# EAGLE design CristmasVillage Driver 1-0 (EAGLE 6.5.0)
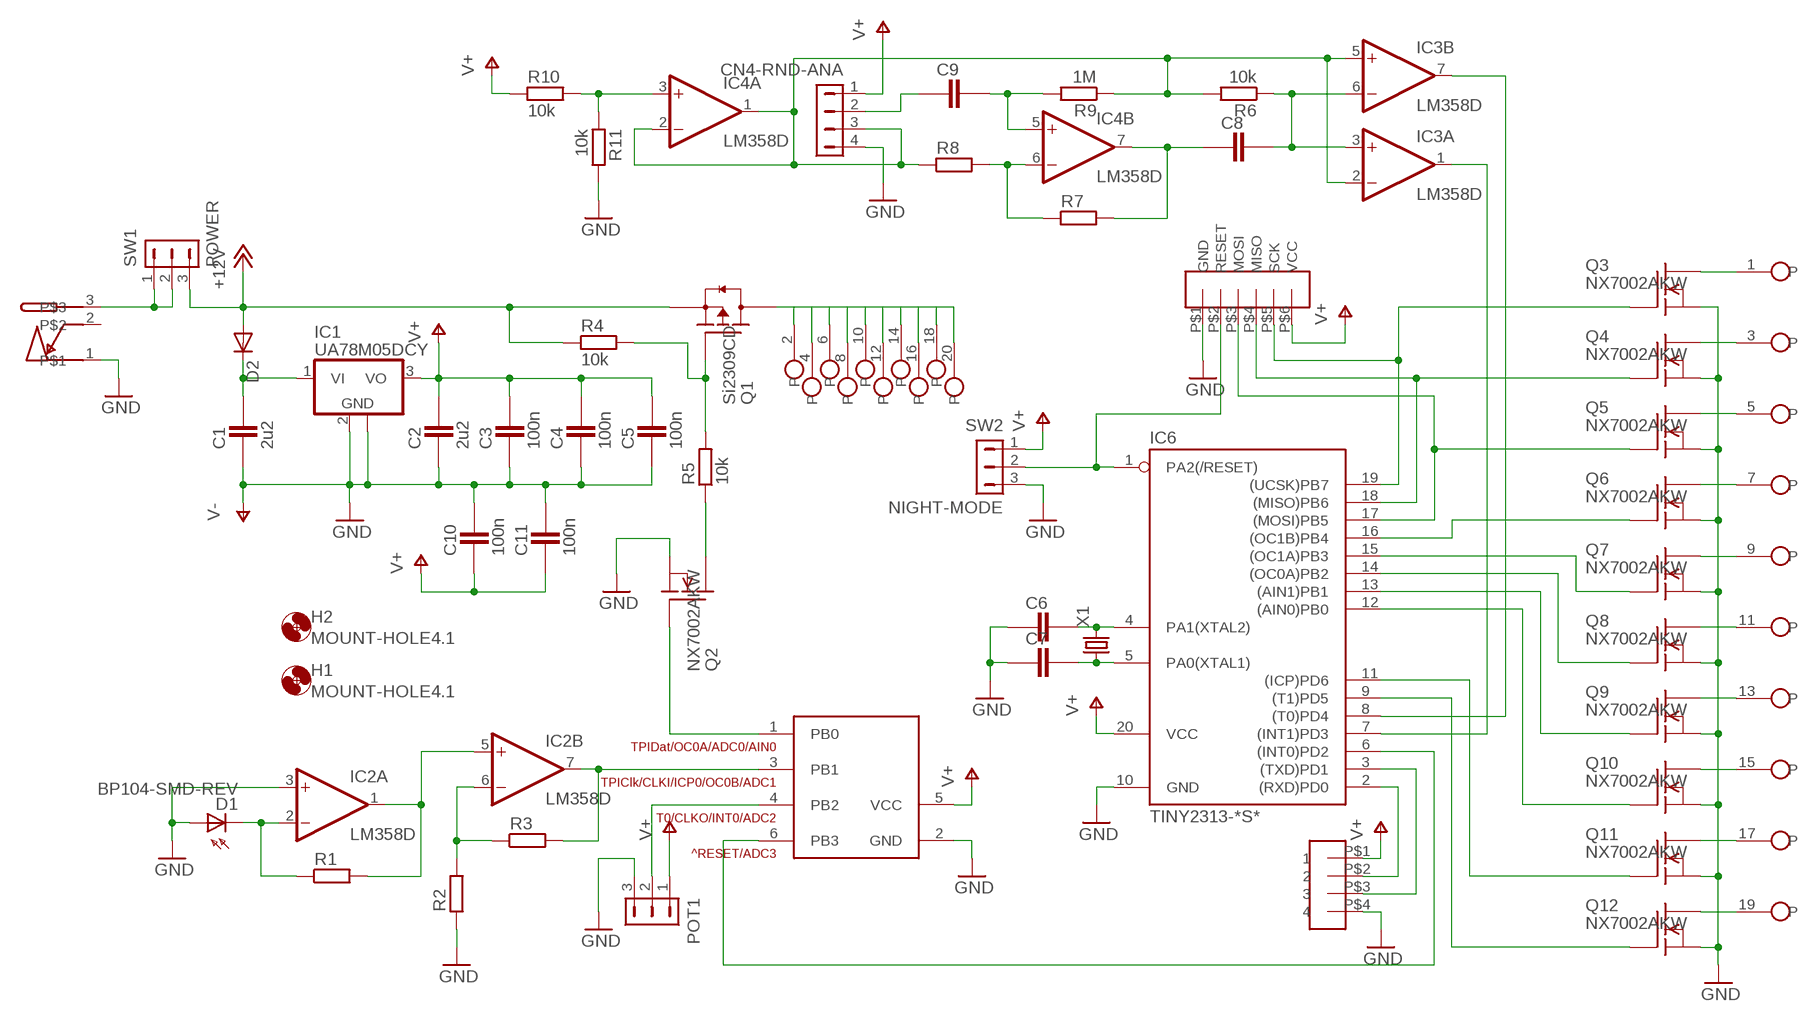
[diagram p0: schematic, sheet 1]

## Parts
C1  2u2  CAPACITOR_1206  [CAPC3215X168N]
C2  2u2  CAPACITOR_1206  [CAPC3215X168N]
C3  100n  CAPACITOR_0603  [CAPC1608X92N]
C4  100n  CAPACITOR_0603  [CAPC1608X92N]
C5  100n  CAPACITOR_0603  [CAPC1608X92N]
C6  CAPACITOR_0603  [CAPC1608X92N]
C7  CAPACITOR_0603  [CAPC1608X92N]
C8  CAPACITOR_1206  [CAPC3215X168N]
C9  CAPACITOR_1206  [CAPC3215X168N]
C10  100n  CAPACITOR_0603  [CAPC1608X92N]
C11  100n  CAPACITOR_0603  [CAPC1608X92N]
CN1  MJ-180SMT  [MJ-180SMT]
CN2-PROG  JST-6PSPI-SIDE-S6B  [6P-H]
CN3-SERIAL  JST-4PSIDE-S4B  [4P-H]
CN4-RND-ANA  HDR-1X4-SIP-100  [SIP-100-4V]
CN5-LEDSTRIPS  HDR_2X10_SIDE-MOUNT  [20PIN-10TOP-10BOT]
D1  BP104-SMD-REV  [BR104SMDREV]
D2  DIODE-MINIMELF  [MINIMELF]
H1  MOUNT-HOLE4.1  [4,1]
H2  MOUNT-HOLE4.1  [4,1]
IC1  UA78M05DCY  [SOT223]
IC2  LM358D  [SO08]
IC3  LM358D  [SO08]
IC4  LM358D  [SO08]
IC5  ATTINY-4/5/9/10  [SOT23-6]
IC6  TINY2313-*S*  [SO20L$]
POT1  HDR-1X3-MTE-100  [MTE-100-3V]
Q1  Si2309CD  MOSFET-PCH_SOT-23  [SOT95P280X135-3N]
Q2  NX7002AKW  [SOT323R]
Q3  NX7002AKW  [SOT323R]
Q4  NX7002AKW  [SOT323R]
Q5  NX7002AKW  [SOT323R]
Q6  NX7002AKW  [SOT323R]
Q7  NX7002AKW  [SOT323R]
Q8  NX7002AKW  [SOT323R]
Q9  NX7002AKW  [SOT323R]
Q10  NX7002AKW  [SOT323R]
Q11  NX7002AKW  [SOT323R]
Q12  NX7002AKW  [SOT323R]
R1  RESISTOR_0603  [RESC1608X55N]
R2  RESISTOR_0603  [RESC1608X55N]
R3  RESISTOR_0603  [RESC1608X55N]
R4  10k  RESISTOR_0603  [RESC1608X55N]
R5  10k  RESISTOR_0603  [RESC1608X55N]
R6  10k  RESISTOR_0603  [RESC1608X55N]
R7  RESISTOR_0603  [RESC1608X55N]
R8  RESISTOR_0603  [RESC1608X55N]
R9  1M  RESISTOR_0603  [RESC1608X55N]
R10  10k  RESISTOR_0603  [RESC1608X55N]
R11  10k  RESISTOR_0603  [RESC1608X55N]
SW1  POWER  HDR-1X3-MTE-100  [MTE-100-3V]
SW2  NIGHT-MODE  HDR-1X3-MTE-100  [MTE-100-3V]
X1  CRYSTALSM49  [SM49]

## Nets
+12V: D2.A Q1.2(S) R4.1 SW1.3
GND: C1.1 C2.1 C3.1 C4.1 C5.1 C6.1 C7.1 C10.2 C11.2 CN1.1 CN2-PROG.P$1(GND) CN3-SERIAL.P$4 CN4-RND-ANA.4 D1.1(A) IC1.2(GND) IC1.4(GND) IC2.3(A:+IN) IC5.2(GND) IC6.10(GND) POT1.3 Q2.2(S) Q3.2(S) Q4.2(S) Q5.2(S) Q6.2(S) Q7.2(S) Q8.2(S) Q9.2(S) Q10.2(S) Q11.2(S) Q12.2(S) R2.1 R11.2 SW2.3 ; supply symbol labelled V-
HALF-VCC: CN4-RND-ANA.3 IC3.2(A:-IN) IC3.5(B:+IN) IC4.1(A:OUT) IC4.2(A:-IN) R6.2 R8.1 R9.1
MISO: CN2-PROG.P$4(MISO) IC6.18((MISO)PB6) Q4.1(G)
MOSI: CN2-PROG.P$3(MOSI) IC6.17((MOSI)PB5) Q5.1(G)
N$1: C1.2 D2.C IC1.1(VI)
N$2: D1.2(C) IC2.2(A:-IN) R1.1
N$3: IC2.1(A:OUT) IC2.5(B:+IN) R1.2
N$4: CN3-SERIAL.P$2 IC6.2((RXD)PD0)
N$5: CN3-SERIAL.P$3 IC6.3((TXD)PD1)
N$6: IC2.6(B:-IN) R2.2 R3.1
N$7: IC2.7(B:OUT) IC5.3(PB1) R3.2
N$8: IC6.9((T1)PD5) Q12.1(G)
N$9: IC5.1(PB0) Q2.1(G)
N$10: IC6.11((ICP)PD6) Q11.1(G)
N$11: C6.2 IC6.4(PA1(XTAL2)) X1.2
N$12: C7.2 IC6.5(PA0(XTAL1)) X1.1
N$13: IC6.12((AIN0)PB0) Q10.1(G)
N$14: IC6.13((AIN1)PB1) Q9.1(G)
N$15: IC6.14((OC0A)PB2) Q8.1(G)
N$16: IC6.15((OC1A)PB3) Q7.1(G)
N$17: CN2-PROG.P$2(RESET) IC6.1(PA2(/RESET)) SW2.2
N$18: IC5.6(PB3) IC6.6((INT0)PD2)
N$19: IC5.4(PB2) POT1.2
N$20: IC6.16((OC1B)PB4) Q6.1(G)
N$21: CN5-LEDSTRIPS.1 Q3.3(D)
N$22: CN1.3 SW1.1 SW1.2
N$23: CN5-LEDSTRIPS.3 Q4.3(D)
N$24: CN5-LEDSTRIPS.5 Q5.3(D)
N$25: CN5-LEDSTRIPS.7 Q6.3(D)
N$26: CN5-LEDSTRIPS.9 Q7.3(D)
N$27: CN5-LEDSTRIPS.11 Q8.3(D)
N$28: CN5-LEDSTRIPS.13 Q9.3(D)
N$29: CN5-LEDSTRIPS.15 Q10.3(D)
N$30: CN5-LEDSTRIPS.17 Q11.3(D)
N$31: CN5-LEDSTRIPS.19 Q12.3(D)
N$32: CN5-LEDSTRIPS.2 CN5-LEDSTRIPS.4 CN5-LEDSTRIPS.6 CN5-LEDSTRIPS.8 CN5-LEDSTRIPS.10 CN5-LEDSTRIPS.12 CN5-LEDSTRIPS.14 CN5-LEDSTRIPS.16 CN5-LEDSTRIPS.18 CN5-LEDSTRIPS.20 Q1.3(D)
N$33: Q1.1(G) R4.2 R5.2
N$34: Q2.3(D) R5.1
N$35: IC3.1(A:OUT) IC6.7((INT1)PD3)
N$36: IC3.7(B:OUT) IC6.8((T0)PD4)
N$37: C8.2 IC3.3(A:+IN) IC3.6(B:-IN) R6.1
N$38: IC4.3(A:+IN) R10.2 R11.1
N$39: C8.1 IC4.7(B:OUT) R7.2
N$40: IC4.6(B:-IN) R7.1 R8.2
N$41: C9.2 IC4.5(B:+IN) R9.2
RANDOM-ANALOG-SIG: C9.1 CN4-RND-ANA.2
SCK: CN2-PROG.P$5(SCK) IC6.19((UCSK)PB7) Q3.1(G)
V+: C2.2 C3.2 C4.2 C5.2 C10.1 C11.1 CN2-PROG.P$6(VCC) CN3-SERIAL.P$1 CN4-RND-ANA.1 IC1.3(VO) IC5.5(VCC) IC6.20(VCC) POT1.1 R10.1 SW2.1
Unconnected: CN1.2

## Power pins joined to a net without a drawn wire
GND: IC2.4(P:V-) IC3.4(P:V-) IC4.4(P:V-)
V+: IC2.8(P:V+) IC3.8(P:V+) IC4.8(P:V+)

## Library data of the parts
C1-C11 = ipc-7351-capacitor:CAPACITOR_
CN1 = con-Multicomp:MJ-180SMT
CN2-PROG = avr-6:JST-6P
CN3-SERIAL = Connector-2mm:JST-4P
CN4-RND-ANA = con-hdrs40:HDR-1X4: HEADER CONNECTOR
CN5-LEDSTRIPS = con-SideHeader:HDR_2X10_SIDE-MOUNT
D1 = Vishay:BP104: PHOTO DIODE
D2 = diode:DIODE-: DIODE
H1 H2 = holes:MOUNT-HOLE: MOUNTING HOLE with drill center marker
IC1 = linear:UA78M*: POSITIVE-VOLTAGE REGULATORS Source: http://focus.ti.com/lit/ds/symlink/ua78m33.pdf
IC2-IC4 = linear4:LM358: OP AMP
IC5 = avr-6:ATTINY-4/5/9/10
IC6 = avr-6:TINY2313*: Atmel Tiny2313 2K Flash, 128 bytes EEPROM, 128 bytes RAM
POT1 SW1 SW2 = con-hdrs40:HDR-1X3: HEADER CONNECTOR
Q1 = ipc-7351-transistor:MOSFET-PCH_
Q2-Q12 = ZeroCross Project:NX7002AKW
R1-R11 = ipc-7351-resistor:RESISTOR_
X1 = crystal:CRYSTAL: CRYSTAL

## Board
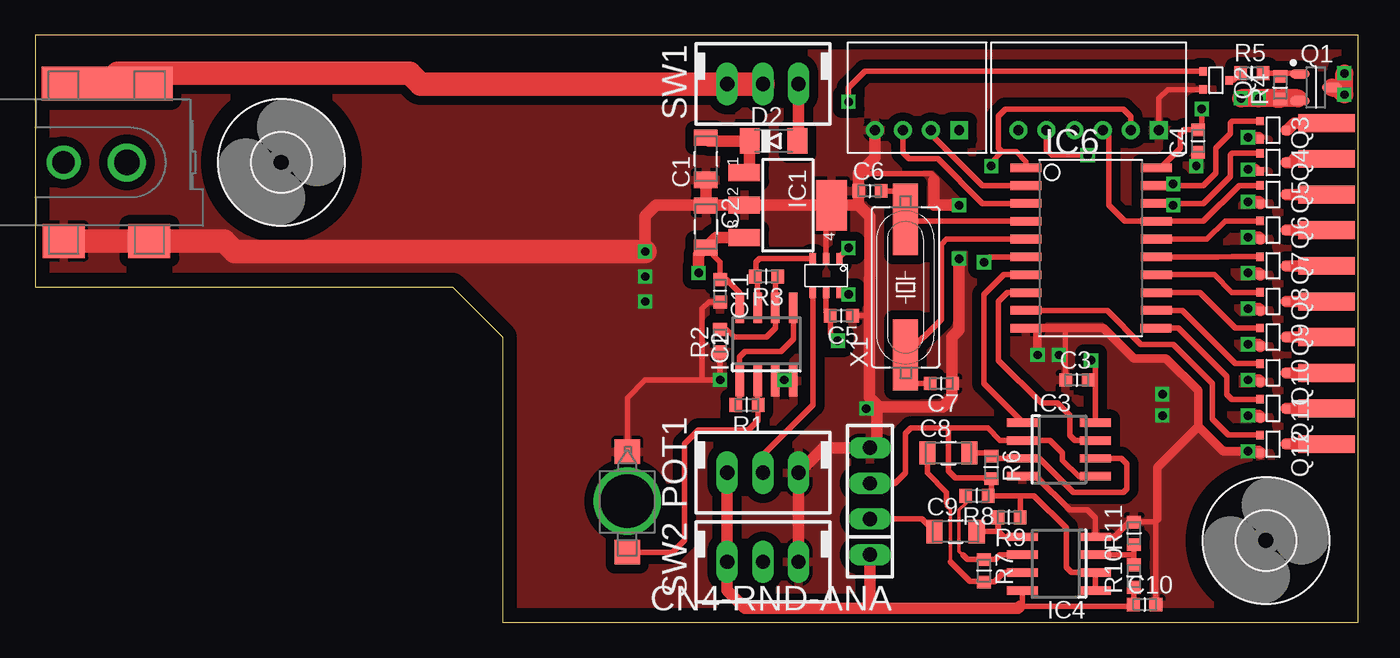
[diagram p1: board, top side]
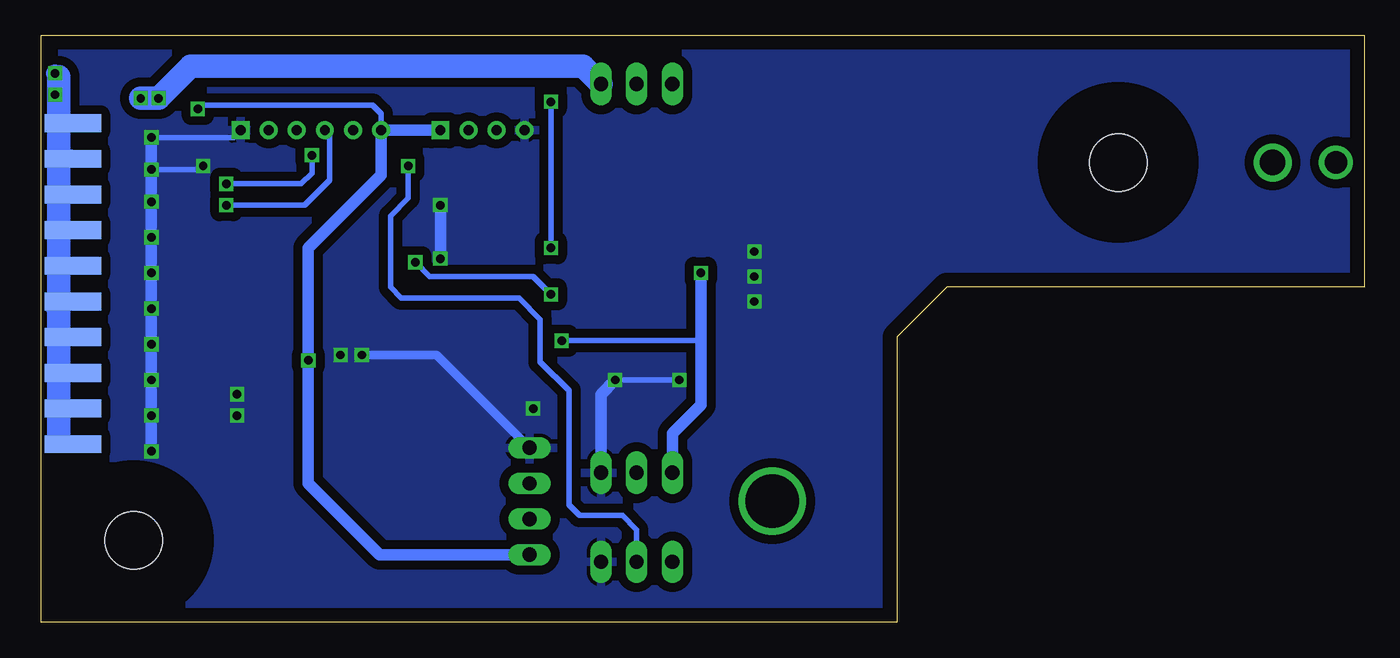
[diagram p2: board, bottom side, seen from below]

Size 94.21 x 41.83 mm. Coordinates in mm from the lower left corner, seen from the top.
Outline: 33.27,0 94.21,0 94.21,41.83 0,41.83 0,23.88 29.72,23.88 33.27,20.32 33.27,0
Copper layers (1*16): Top 0.035mm / dielectric 1.5mm / Bottom 0.035mm
Design rules "default": minimum track width 10mil, minimum drill 24mil, track to track 8mil, track to pad 8mil, pad to pad 8mil, via to via 8mil, smd to smd 8mil, copper to edge 40mil, drill to drill 8mil, minimum pad ring 10mil, minimum via ring 8mil, stop-mask expansion 4mil, vias tented up to drill 0mil, thermal gap 10mil

### Footprints (pad centres in the part's own frame; a part is rotated, then mirrored left to right if it is on the bottom)
CAPC3215X168N = smd 1.15 x 1.65: 1 -1.5,0; 2 1.5,0
CAPC1608X92N = smd 0.9 x 0.95: 1 -0.8,0; 2 0.8,0
MJ-180SMT = smd 3 x 2.4: 1 0,-5.6; 2 6.1,-5.6 | smd 9.3 x 2.4: 3 3.1,5.6 | drill 1.6 pad 1.93: P$1 0,0 | drill 1.8 pad 2.184: P$2 4.5,0
6P-H = drill 0.7 pad 1.27 square: P$1 0,0 | drill 0.7 pad 1.27: P$2 2,0; P$3 4,0; P$4 6,0; P$5 8,0; P$6 10,0
4P-H = drill 0.7 pad 1.27 square: P$1 0,0 | drill 0.7 pad 1.27: P$2 2,0; P$3 4,0; P$4 6,0
SIP-100-4V = drill 1.016 long: 1 -3.81,0; 2 -1.27,0; 3 1.27,0; 4 3.81,0
20PIN-10TOP-10BOT = smd 1.27 x 4: 1 0,0; 3 2.54,0; 5 5.08,0; 7 7.62,0; 9 10.16,0; 11 12.7,0; 13 15.24,0; 15 17.78,0; 17 20.32,0; 19 22.86,0 | smd 1.27 x 4 bottom: 2 0,0; 4 2.54,0; 6 5.08,0; 8 7.62,0; 10 10.16,0; 12 12.7,0; 14 15.24,0; 16 17.78,0; 18 20.32,0; 20 22.86,0
BR104SMDREV = smd 1.75 x 1.8: 1 -3.525,0; 2 3.625,0 | drill 3.8 pad 3.8: P$1 0,0
MINIMELF = smd 1.4 x 1.8: A 1.7,0; C -1.7,0
4,1 = hole 4.1: 0,0
SOT223 = smd 1.219 x 2.235: 1 -2.311,-3.099; 2 0,-3.099; 3 2.311,-3.099 | smd 3.6 x 2.2: 4 0,3.099
SO08 = smd 0.6 x 2.2: 1 -1.905,-2.6; 2 -0.635,-2.6; 3 0.635,-2.6; 4 1.905,-2.6; 5 1.905,2.6; 6 0.635,2.6; 7 -0.635,2.6; 8 -1.905,2.6
SOT23-6 = smd 0.8 x 0.45: 1 0,1.9; 2 0,0.95; 3 0,0; 4 2.4,0; 5 2.4,0.95; 6 2.4,1.9
SO20L$ = smd 0.61 x 2.21: 1 -5.715,-4.636; 2 -4.445,-4.636; 3 -3.175,-4.636; 4 -1.905,-4.636; 5 -0.635,-4.636; 6 0.635,-4.636; 7 1.905,-4.636; 8 3.175,-4.636; 9 4.445,-4.636; 10 5.715,-4.636; 11 5.715,4.61; 12 4.445,4.636; 13 3.175,4.636; 14 1.905,4.636; 15 0.635,4.636; 16 -0.635,4.636; 17 -1.905,4.636; 18 -3.175,4.636; 19 -4.445,4.636; 20 -5.715,4.636
MTE-100-3V = drill 1.016 long: 1 -2.54,0; 2 0,0; 3 2.54,0
SOT95P280X135-3N = smd 1.4 x 0.65: 1 -1.15,0.95; 2 -1.15,-0.95; 3 1.15,0
SOT323R = smd 0.6 x 0.55: 1 -0.65,-0.925; 2 0.65,-0.925; 3 0,0.925
RESC1608X55N = smd 0.9 x 1: 1 -0.8,0; 2 0.8,0
SM49 = smd 5.08 x 1.778: 1 -4.826,0; 2 4.826,0

### Placement (x,y rotation side)
C1  47.75,33.02 90 top
C2  47.75,28.19 270 top
C3  74.17,17.27 0 top
C4  82.8,34.29 90 top
C5  57.4,21.84 180 top
C6  59.44,30.73 0 top
C7  64.52,17.02 180 top
C8  65.02,12.07 0 top
C9  65.53,6.48 0 top
C10  78.99,1.27 0 top
C11  48.77,23.62 270 top
CN1  2.03,32.77 0 top
CN2-PROG  80.01,35.05 180 top
CN3-SERIAL  65.79,35.05 180 top
CN4-RND-ANA  59.44,8.64 90 top
CN5-LEDSTRIPS  91.95,35.56 270 top
D1  42.16,8.64 270 top
D2  52.58,34.29 0 top
H1  87.63,5.84 0 top
H2  17.53,32.77 0 top
IC1  53.59,29.72 270 top
IC2  52.07,19.81 0 top
IC3  72.9,12.32 270 top
IC4  72.9,4.19 90 top
IC5  55.37,25.91 270 top
IC6  75.18,26.67 270 top
POT1  51.82,10.67 0 top
Q1  91.19,38.1 0 top
Q2  84.07,38.61 270 top
Q3  88.14,35.05 270 top
Q4  88.14,32.77 270 top
Q5  88.14,30.48 270 top
Q6  88.14,27.94 270 top
Q7  88.14,25.4 270 top
Q8  88.14,22.86 270 top
Q9  88.14,20.32 270 top
Q10  88.14,17.78 270 top
Q11  88.14,15.24 270 top
Q12  88.14,12.7 270 top
R1  50.67,15.49 180 top
R2  48.77,20.07 90 top
R3  52.07,24.64 180 top
R4  88.65,38.1 90 top
R5  86.61,39.12 0 top
R6  68.07,11.05 270 top
R7  67.56,3.68 270 top
R8  67.06,9.02 180 top
R9  69.34,7.49 180 top
R10  78.23,3.3 90 top
R11  78.23,6.35 90 top
SW1  51.82,38.35 0 top
SW2  51.82,4.32 0 top
X1  61.98,23.88 90 top

### Tracks (layer width: path | path; a pad name or v marks a point on that pad's centre or on a via)
+12V  (via drill 0.6)
  Top 0.813: Q1.2 90.04,37.22 89.92,37.34 | SW1.3 54.36,34.37 D2.A
  Top 1.27: 89.92,37.34 88.68,37.34 R4.1 88.43,37.3 88.39,37.34 v87.12,37.34 v85.85,37.34
  Bottom 1.676: SW1.3 55.63,39.62 83.57,39.62 v85.85,37.34 v87.12,37.34
GND  (via drill 0.6)
  Top 0.305: 55.81,29.65 55.88,29.72
  Top 0.406: Q3.2 87.21,34.45 87.12,34.54 | 86.87,32.26 87.07,32.26 Q4.2 | CN2-PROG.P$1 80.01,37.34 80.63,37.96 Q2.2 | C4.1 82.8,32.64 v82.68,32.51 | 58.64,31.97 63.79,31.97 64.01,31.75 64.01,31.5 | C3.1 73.37,20.92 73.41,20.96 | IC3.4 71.25,10.41 73.66,8 74.93,8 75.5,7.43 IC4.4 76.83,6.1 77.89,7.15 R11.2 79.76,7.15 79.79,7.11 | C10.2 79.79,7.11 | 79.79,7.11 79.79,7.28 79.88,7.37 | IC5.2 56.32,29.35 IC1.4 | C5.1 59.16,21.84 59.42,21.59 | IC6.10 71.25,20.96 71.37,20.83 | R2.1 v48.77,17.27 47.5,17.27 | IC2.4 53.91,17.27 v53.34,17.27 52.83,17.27 52.77,17.21 IC2.3 | 47.5,17.27 47.5,22.35 47.97,22.82 C11.2 | 42.64,12.16 D1.1 42.16,16 43.43,17.27 47.5,17.27
  Top 0.61: IC6.10 73.41,20.96 76.07,20.96 78.23,18.8 80.52,18.8 82.8,16.51 82.8,13.97 | 82.8,13.97 84.58,12.19 v86.36,12.19 | 79.88,7.37 79.88,11.05 82.8,13.97 | 71.37,20.83 v71.37,19.05
  Top 0.813: 87.12,34.54 v86.36,34.54 | v86.36,32.26 86.87,32.26 | Q5.2 87.21,29.88 87.12,29.97 v86.36,29.97 | Q6.2 87.21,27.34 87.12,27.43 v86.36,27.43 | Q7.2 87.21,24.8 87.12,24.89 v86.36,24.89 | Q8.2 87.21,22.26 87.12,22.35 v86.36,22.35 | Q9.2 87.21,19.72 87.12,19.81 v86.36,19.81 | Q10.2 87.21,17.18 87.12,17.27 v86.36,17.27 | Q11.2 87.21,14.64 87.12,14.73 v86.36,14.73 | Q12.2 87.21,12.1 87.12,12.19 v86.36,12.19 | 58.64,29.72 C6.1 58.64,31.97 59.79,33.12 CN3-SERIAL.P$4 | 58.64,29.72 59.44,28.92 59.44,27.69 59.42,21.59 59.4,16.04 60.07,15.37 | v65.79,25.91 65.79,20.83 65.28,20.32 65.28,17.06 C7.1 65.28,16.98 65.28,16 64.64,15.37 60.07,15.37 | v65.79,29.72 64.01,29.72 64.01,31.5 | 60.07,15.37 59.94,15.37 59.94,12.95 CN4-RND-ANA.4 56.13,12.45 POT1.3 SW2.3 | C1.1 C2.1 | C2.1 47.78,29.72 IC1.2 55.88,29.72 IC1.4 58.64,29.72 | v43.43,26.42 43.43,28.96 44.2,29.72 47.73,29.72 C2.1
  Top 1.676: CN1.1 8.12,27.17 8.13,27.18 13.46,27.18 14.22,26.42 v43.43,26.42
  Bottom 0.406: v86.36,34.54 80.52,34.54 CN2-PROG.P$1 | v82.68,32.51 82.93,32.26 v86.36,32.26 | v48.77,17.27 v53.34,17.27
  Bottom 0.61: v71.37,19.05 66.04,19.05 CN4-RND-ANA.4
  Bottom 0.813: v86.36,34.54 v86.36,32.26 v86.36,29.97 v86.36,27.43 v86.36,24.89 v86.36,22.35 v86.36,19.81 v86.36,17.27 v86.36,14.73 v86.36,12.19 | v65.79,29.72 v65.79,25.91 | POT1.3 54.36,16.26 v53.34,17.27
  other vias: 43.43,24.64 43.43,22.86 59.18,15.24 72.9,19.05 80.26,16.26 80.26,14.73
  pour Bottom (isolate 0.635): 33.27,20.32 29.72,23.88 0,23.88 0,41.91 94.23,41.91 94.23,0 33.27,0
  pour Top (isolate 0.635): 0,23.88 0,40.39 1.52,41.91 94.23,41.91 94.23,0 33.27,0 33.27,20.32 29.72,23.88
HALF-VCC
  Top 0.406: IC3.5 74.3,10.41 73.15,11.56 73.15,12.07 72.26,12.95 IC3.2 68.71,12.95 67.82,13.84 65.15,13.84 | IC4.1 IC4.2 73.79,3.56 73.41,3.94 73.41,6.73 71.12,9.02 70.1,9.02 | R9.1 70.14,8.98 70.1,9.02 | 70.1,9.02 R8.1 68.07,9.23 R6.2 67.6,10.25 67.56,10.29 65.53,10.29 65.02,10.79 65.02,13.72 65.15,13.84 | CN4-RND-ANA.3 61.21,9.91 61.98,10.67 61.98,13.46 62.36,13.84 65.15,13.84
MISO  (via drill 0.6)
  Top 0.406: Q4.1 85.23,33.42 85.09,33.27 85.09,31.75 83.19,29.85 IC6.18 80.9,29.85 v81.03,29.72
  Bottom 0.406: v81.03,29.72 75.44,29.72 73.66,31.5 73.66,34.7 CN2-PROG.P$4
MOSI
  Top 0.406: Q5.1 85.74,31.13 83.19,28.57 IC6.17 77.6,28.57 76.45,29.72 76.45,34.61 CN2-PROG.P$3
N$1
  Top 0.813: C1.2 47.98,34.29 D2.C 50.88,32.41 IC1.1
N$2
  Top 0.406: IC2.2 51.44,15.53 R1.1 51.47,14.39 50.8,13.72 47.24,13.72 46.23,12.7 46.23,5.84 45.4,5.01 D1.2
N$3
  Top 0.406: IC2.5 53.97,20.19 53.09,19.3 50.55,19.3 50.16,18.92 IC2.1 50.16,15.79 R1.2
N$4
  Top 0.406: CN3-SERIAL.P$2 63.79,34.77 67.44,31.11 IC6.2
N$5
  Top 0.406: IC6.3 67.44,29.85 64.26,33.02 62.23,33.02 61.79,33.46 CN3-SERIAL.P$3
N$6
  Top 0.406: R3.1 52.7,24.47 IC2.6 52.7,20.96 52.07,20.32 49.78,20.32 49.28,20.83 48.81,20.83 R2.2
N$7
  Top 0.406: IC5.3 51.56,25.91 51.31,25.65 51.31,24.68 R3.2 51.44,24.47 IC2.7
N$8
  Top 0.406: IC6.9 76.33,22.22 78.74,19.81 81.03,19.81 83.82,17.02 83.82,14.48 84.95,13.35 Q12.1
N$9  (via drill 0.6)
  Top 0.406: IC5.1 57.27,26.03 v57.91,26.67 | v57.91,37.08 57.91,38.1 59.07,39.26 Q2.1
  Bottom 0.406: v57.91,26.67 v57.91,37.08
N$10
  Top 0.406: IC6.11 81.41,20.96 84.84,17.53 84.84,16.26 85.2,15.89 Q11.1
N$11
  Top 0.406: IC6.4 62.1,28.57 X1.2 61.98,30.48 61.72,30.73 C6.2
N$12
  Top 0.406: IC6.5 64.9,27.31 64.52,26.92 64.52,21.59 X1.1 61.98,17.53 62.48,17.02 C7.2
N$13
  Top 0.406: IC6.12 81.66,22.22 85.46,18.43 Q10.1
N$14
  Top 0.406: IC6.13 82.93,23.5 85.46,20.97 Q9.1
N$15
  Top 0.406: IC6.14 83.95,24.76 85.2,23.51 Q8.1
N$16
  Top 0.406: Q7.1 85.23,26.05 84.2,26.04 IC6.15
N$17  (via drill 0.6)
  Top 0.406: CN2-PROG.P$2 78.01,36.04 77.47,36.58 69.09,36.58 68.58,36.07 68.58,33.78 68.83,33.53 | 68.83,33.53 69.85,33.53 70.55,32.83 IC6.1 | v68.07,32.51 68.07,32.77 68.83,33.53
  Bottom 0.406: SW2.2 51.82,6.6 52.83,7.62 55.88,7.62 56.64,8.38 56.64,16.51 58.67,18.54 58.67,21.59 60.2,23.11 68.58,23.11 69.34,23.88 69.34,28.96 68.07,30.23 v68.07,32.51
N$18  (via drill 0.6)
  Top 0.406: 67.82,25.91 v67.56,25.65 67.94,26.04 IC6.6 | v57.91,23.37 57.41,23.37 IC5.6
  Bottom 0.406: v57.91,23.37 59.18,24.64 66.55,24.64 v67.56,25.65
N$19
  Top 0.406: POT1.2 51.82,11.94 55.37,15.49 IC5.4
N$20
  Top 0.406: IC6.16 83.44,27.31 84.72,28.59 Q6.1
N$21
  Top 0.813: Q3.3 89.15,35.05 89.66,35.56 CN5-LEDSTRIPS.1
N$22
  Top 1.676: SW1.2 SW1.1 27.43,38.35 26.67,39.12 5.88,39.12 CN1.3
N$23
  Top 0.813: Q4.3 89.41,32.77 89.66,33.02 CN5-LEDSTRIPS.3
N$24
  Top 0.813: Q5.3 CN5-LEDSTRIPS.5
N$25
  Top 0.813: Q6.3 CN5-LEDSTRIPS.7
N$26
  Top 0.813: Q7.3 CN5-LEDSTRIPS.9
N$27
  Top 0.813: Q8.3 CN5-LEDSTRIPS.11
N$28
  Top 0.813: Q9.3 CN5-LEDSTRIPS.13
N$29
  Top 0.813: Q10.3 CN5-LEDSTRIPS.15
N$30
  Top 0.813: Q11.3 CN5-LEDSTRIPS.17
N$31
  Top 0.813: Q12.3 CN5-LEDSTRIPS.19
N$32  (via drill 0.6)
  Top 1.27: Q1.3 92.71,38.1 v93.22,37.59 v93.22,39.12
  Bottom 0.61: 93.22,14.99 92.96,14.99 | 93.22,17.53 92.96,17.53 | 93.22,20.07 92.96,20.07 | 93.22,22.35 93.22,22.61 92.96,22.86 | 93.22,25.15 92.96,25.15 | 93.22,27.69 92.96,27.69 | CN5-LEDSTRIPS.6 92.46,30.48 92.96,29.97 | CN5-LEDSTRIPS.4 92.71,33.02 92.96,33.27 | 93.22,35.56 93.22,36.58 92.96,36.83
  Bottom 1.27: CN5-LEDSTRIPS.20 92.96,12.7 93.22,12.95 92.96,13.21 92.96,13.46 | CN5-LEDSTRIPS.18 92.96,15.24 93.22,14.99 | CN5-LEDSTRIPS.16 92.96,17.78 93.22,17.53 | CN5-LEDSTRIPS.14 92.96,20.32 93.22,20.07 | CN5-LEDSTRIPS.12 92.71,22.86 93.22,22.35 | CN5-LEDSTRIPS.10 92.96,25.4 93.22,25.15 | CN5-LEDSTRIPS.8 92.96,27.94 93.22,27.69 | CN5-LEDSTRIPS.6 92.96,30.48 | CN5-LEDSTRIPS.2 93.22,35.56 | CN5-LEDSTRIPS.4 93.22,33.02 | v93.22,39.12 92.96,38.86
  Bottom 1.676: 92.96,38.86 92.96,36.83 92.96,33.27 92.96,29.97 92.96,27.69 92.96,25.15 92.96,22.86 92.96,20.07 92.96,17.53 92.96,14.99 92.96,13.46
N$33
  Top 0.406: R5.2 88.65,39.12 | 88.65,39.12 89.97,39.12 Q1.1 | R4.2 88.65,39.12
N$34
  Top 0.406: Q2.3 85.31,38.61 R5.1
N$35
  Top 0.406: IC6.7 68.96,24.76 67.56,23.37 67.56,17.02 70.3,14.28 IC3.1
N$36
  Top 0.406: IC6.8 69.22,23.5 68.58,22.86 68.58,18.67 71.63,15.62 72.77,15.62 73.66,14.73 73.66,13.33 74.04,12.95 IC3.7
N$37
  Top 0.406: IC3.6 77.34,11.68 77.72,11.3 77.72,9.53 77.47,9.27 73.91,9.27 71.5,11.68 IC3.3 68.16,11.68 R6.1 67.6,12.07 C8.2
N$38
  Top 0.406: IC4.3 78.1,4.83 78.23,4.95 | 78.23,4.95 R10.2 | R11.1 78.23,4.95
N$39
  Top 0.254: 64.9,8.51 64.9,8.25 65.15,8 65.15,4.32
  Top 0.406: IC4.7 68.96,3.56 68.29,2.88 R7.2 67.53,2.92 66.55,2.92 65.15,4.32 | C8.1 63.52,10.64 64.9,9.27 64.9,8.51
N$40
  Top 0.254: R8.2 66.26,8.47 65.79,8 65.79,5.08 66.04,4.83 | 67.53,4.45 R7.1
  Top 0.406: IC4.6 68.71,4.83 68.36,4.48 R7.1 66.38,4.48 66.04,4.83
N$41
  Top 0.406: IC4.5 68.96,6.1 68.58,6.48 68.58,7.46 R9.2 68.54,6.48 C9.2
RANDOM-ANALOG-SIG
  Top 0.406: CN4-RND-ANA.2 63.14,7.37 C9.1
SCK  (via drill 0.6)
  Top 0.406: Q3.1 85.23,35.7 85.09,35.56 85.09,34.8 84.07,33.78 84.07,32 83.19,31.11 IC6.19 80.9,31.11 v81.03,31.24 | v74.93,33.27 72.39,33.27 72.01,33.65 CN2-PROG.P$5
  Bottom 0.406: v81.03,31.24 75.69,31.24 74.93,32 v74.93,33.27
V+  (via drill 0.6)
  Top 0.406: v83.06,36.58 83.06,35.31 82.84,35.09 C4.2 81.83,35.09 81.53,34.8 81.53,33.78 80.14,32.39 IC6.20 | IC3.8 75.5,17.27 | 75.5,17.27 75.5,18.36 v75.18,18.67 | C3.2 75.5,17.27 | R10.1 78.23,1.31 C10.1 78.07,1.14 70.36,1.14 | 70.1,1.14 70.36,1.14 | IC4.8 70.3,1.2 70.36,1.14 | IC5.5 56.32,22.13 | 56.32,22.13 C5.2 | IC2.8 50.16,23.5 49.24,24.42 C11.1 48.77,25.68 C2.2 | 56.32,22.13 56.64,22.13 56.64,20.57 v57.15,20.07
  Top 0.813: POT1.1 SW2.1 49.28,2.29 50.55,1.02 59.44,1.02 | 59.44,1.02 69.98,1.02 70.1,1.14 | CN4-RND-ANA.1 59.44,1.02 | IC1.3 48.47,27.41 C2.2 47.24,26.19 v47.24,24.89
  Bottom 0.406: v83.06,36.58 82.8,36.83 70.61,36.83 70.01,36.23 CN2-PROG.P$6 | v57.15,20.07 47.24,20.07
  Bottom 0.813: CN3-SERIAL.P$1 CN2-PROG.P$6 70.01,31.84 75.18,26.67 v75.18,18.67 75.18,9.91 70.1,4.83 CN4-RND-ANA.1 | POT1.1 49.28,13.46 47.24,15.49 47.24,20.07 v47.24,24.89